# EAGLE design ProgrammableOLED (EAGLE 7.3.0)
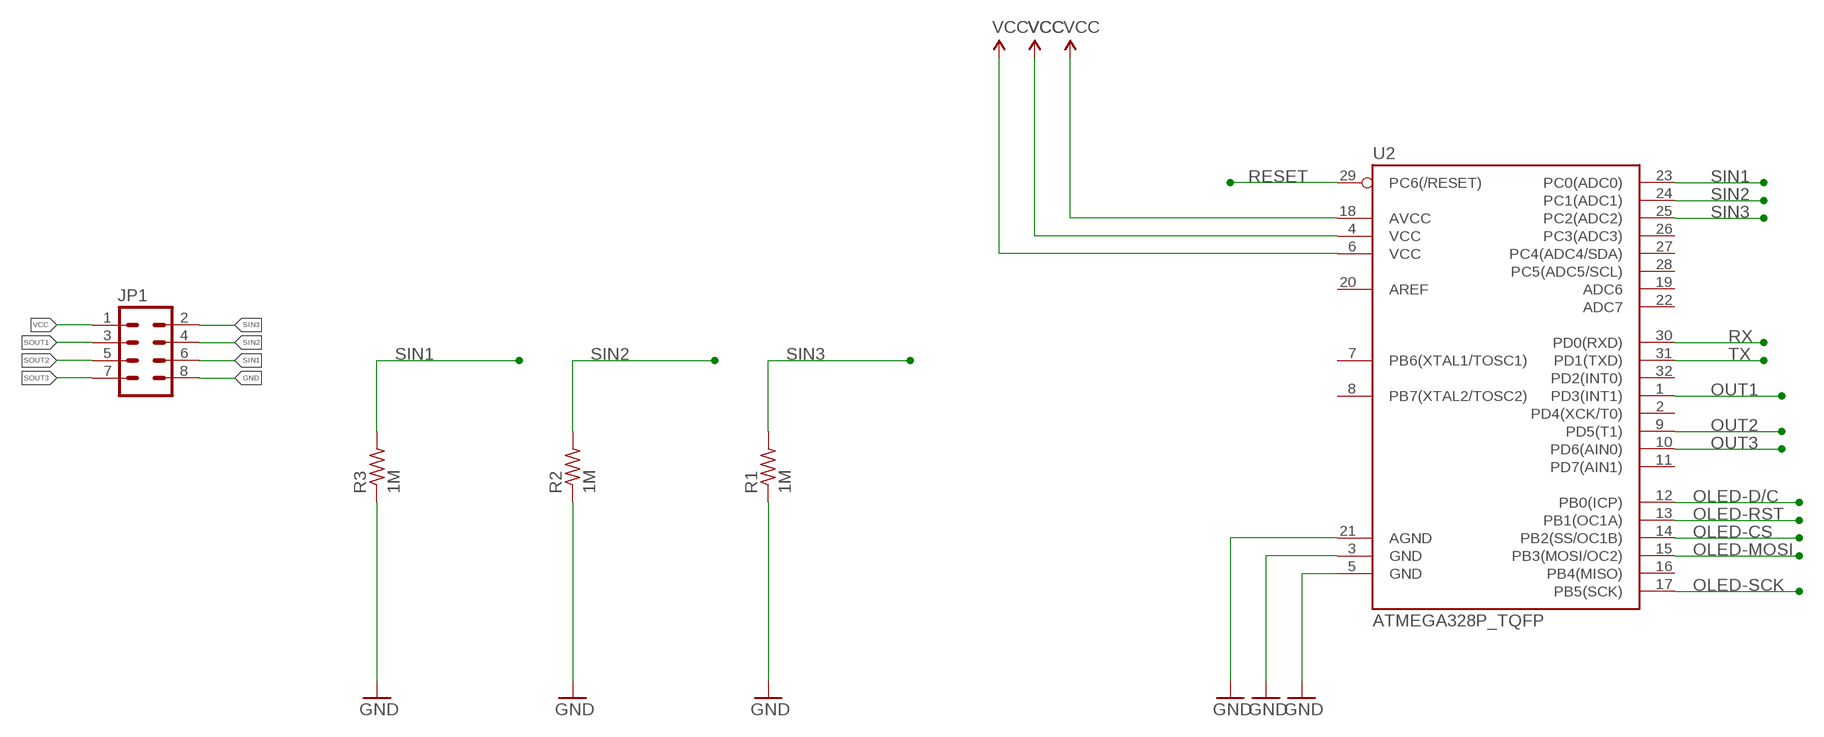
[diagram p0: schematic, sheet 1, part 1 of 2]
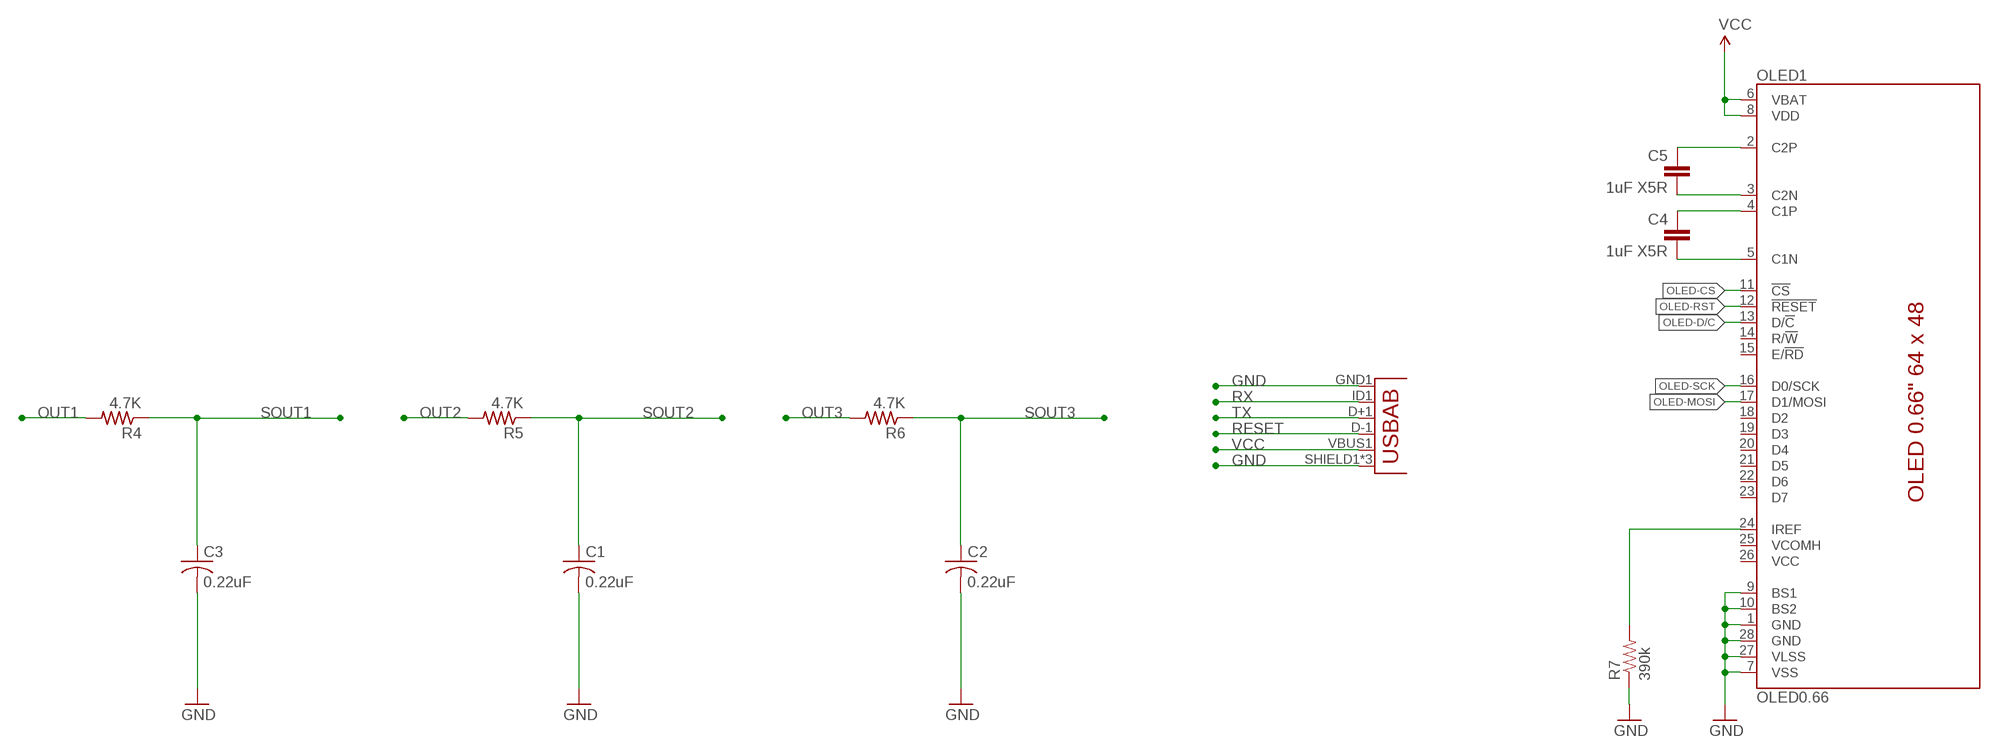
[diagram p1: schematic, sheet 1, part 2 of 2]

## Parts
C1  0.22uF  C-USC0603  [C0603]
C2  0.22uF  C-USC0603  [C0603]
C3  0.22uF  C-USC0603  [C0603]
C4  1uF X5R  CAP0805  [0805]
C5  1uF X5R  CAP0805  [0805]
JP1  M04X2  [2X4]
JP5  USB-ABCONN-11794  [USB-AB-MICRO-SMD_V03]
OLED1  OLED0.66  [OLED-0.66-64X48]
R1  1M  R-US_R0603  [R0603]
R2  1M  R-US_R0603  [R0603]
R3  1M  R-US_R0603  [R0603]
R4  4.7K  R-US_R0603  [R0603]
R5  4.7K  R-US_R0603  [R0603]
R6  4.7K  R-US_R0603  [R0603]
R7  390k  RESISTOR0603-RES  [0603-RES]
U2  ATMEGA328P_TQFP  [TQFP32-08]

## Nets
C1N: C4.2 OLED1.5(C1N)
C1P: C4.1 OLED1.4(C1P)
C2N: C5.2 OLED1.3(C2N)
C2P: C5.1 OLED1.2(C2P)
GND: C1.2 C2.2 C3.2 JP1.8 JP5.GND1(GND) JP5.SHIELD1(SHIELD) JP5.SHIELD2(SHIELD) JP5.SHIELD3(SHIELD) OLED1.1(GND) OLED1.7(VSS) OLED1.9(BS1) OLED1.10(BS2) OLED1.27(VLSS) OLED1.28(GND) R1.1 R2.1 R3.1 R7.1 U2.3(GND) U2.5(GND) U2.21(AGND)
IREF: OLED1.24(IREF) R7.2
OLED-CS: OLED1.11(!CS!) U2.14(PB2(SS/OC1B))
OLED-D/C: OLED1.13(D/!C!) U2.12(PB0(ICP))
OLED-MOSI: OLED1.17(D1/MOSI) U2.15(PB3(MOSI/OC2))
OLED-RST: OLED1.12(!RESET!) U2.13(PB1(OC1A))
OLED-SCK: OLED1.16(D0/SCK) U2.17(PB5(SCK))
OUT1: R4.2 U2.1(PD3(INT1))
OUT2: R5.2 U2.9(PD5(T1))
OUT3: R6.2 U2.10(PD6(AIN0))
RESET: JP5.D-1(D-) U2.29(PC6(/RESET))
RX: JP5.ID1(USBID) U2.30(PD0(RXD))
SIN1: JP1.6 R3.2 U2.23(PC0(ADC0))
SIN2: JP1.4 R2.2 U2.24(PC1(ADC1))
SIN3: JP1.2 R1.2 U2.25(PC2(ADC2))
SOUT1: C3.1 JP1.3 R4.1
SOUT2: C1.1 JP1.5 R5.1
SOUT3: C2.1 JP1.7 R6.1
TX: JP5.D+1(D+) U2.31(PD1(TXD))
VCC: JP1.1 JP5.VBUS1(VBUS) OLED1.6(VBAT) OLED1.8(VDD) U2.4(VCC) U2.6(VCC) U2.18(AVCC)
Unconnected: OLED1.14(R/!W!) OLED1.15(E/!RD!) OLED1.18(D2) OLED1.19(D3) OLED1.20(D4) OLED1.21(D5) OLED1.22(D6) OLED1.23(D7) OLED1.25(VCOMH) OLED1.26(VCC) U2.2(PD4(XCK/T0)) U2.7(PB6(XTAL1/TOSC1)) U2.8(PB7(XTAL2/TOSC2)) U2.11(PD7(AIN1)) U2.16(PB4(MISO)) U2.19(ADC6) U2.20(AREF) U2.22(ADC7) U2.26(PC3(ADC3)) U2.27(PC4(ADC4/SDA)) U2.28(PC5(ADC5/SCL)) U2.32(PD2(INT0))

## Library data of the parts
C1-C3 = adafruit:C-US: CAPACITOR, American symbol
C4 C5 = SparkFun-Passives:CAP: Capacitor Standard 0603 ceramic capacitor, and 0.1" leaded capacitor.
JP1 = SparkFun-Connectors:M04X2: .1" header, two rows of four.
JP5 = SparkFun-Connectors:USB-AB: This is a USB AB connector that is compatible with USB OTG. i.e. this connector can serve as a host or device; PROD_ID: CONN-11794
OLED1 = microView-temp:OLED0.66
R1-R6 = adafruit:R-US_: RESISTOR, American symbol
R7 = SparkFun-Passives:RESISTOR: Resistor Basic schematic elements and footprints for 0603, 1206, and PTH resistors.
U2 = SparkFun-DigitalIC:ATMEGA328P_TQFP; PROD_ID: IC-09069

## Board
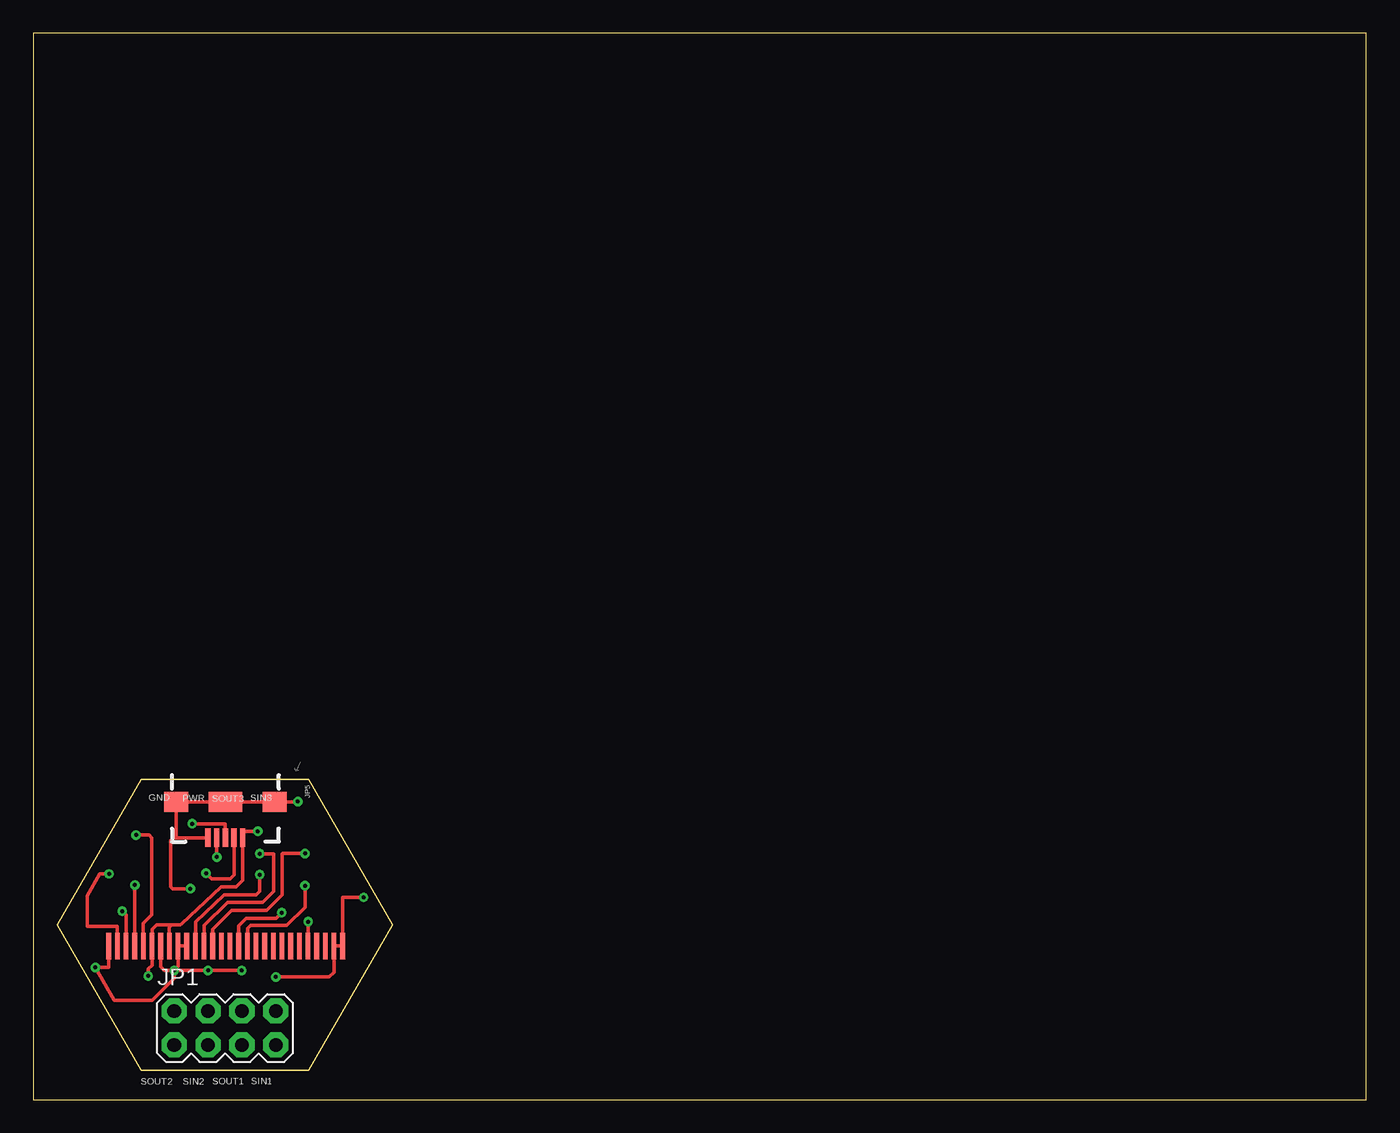
[diagram p2: board, top side]
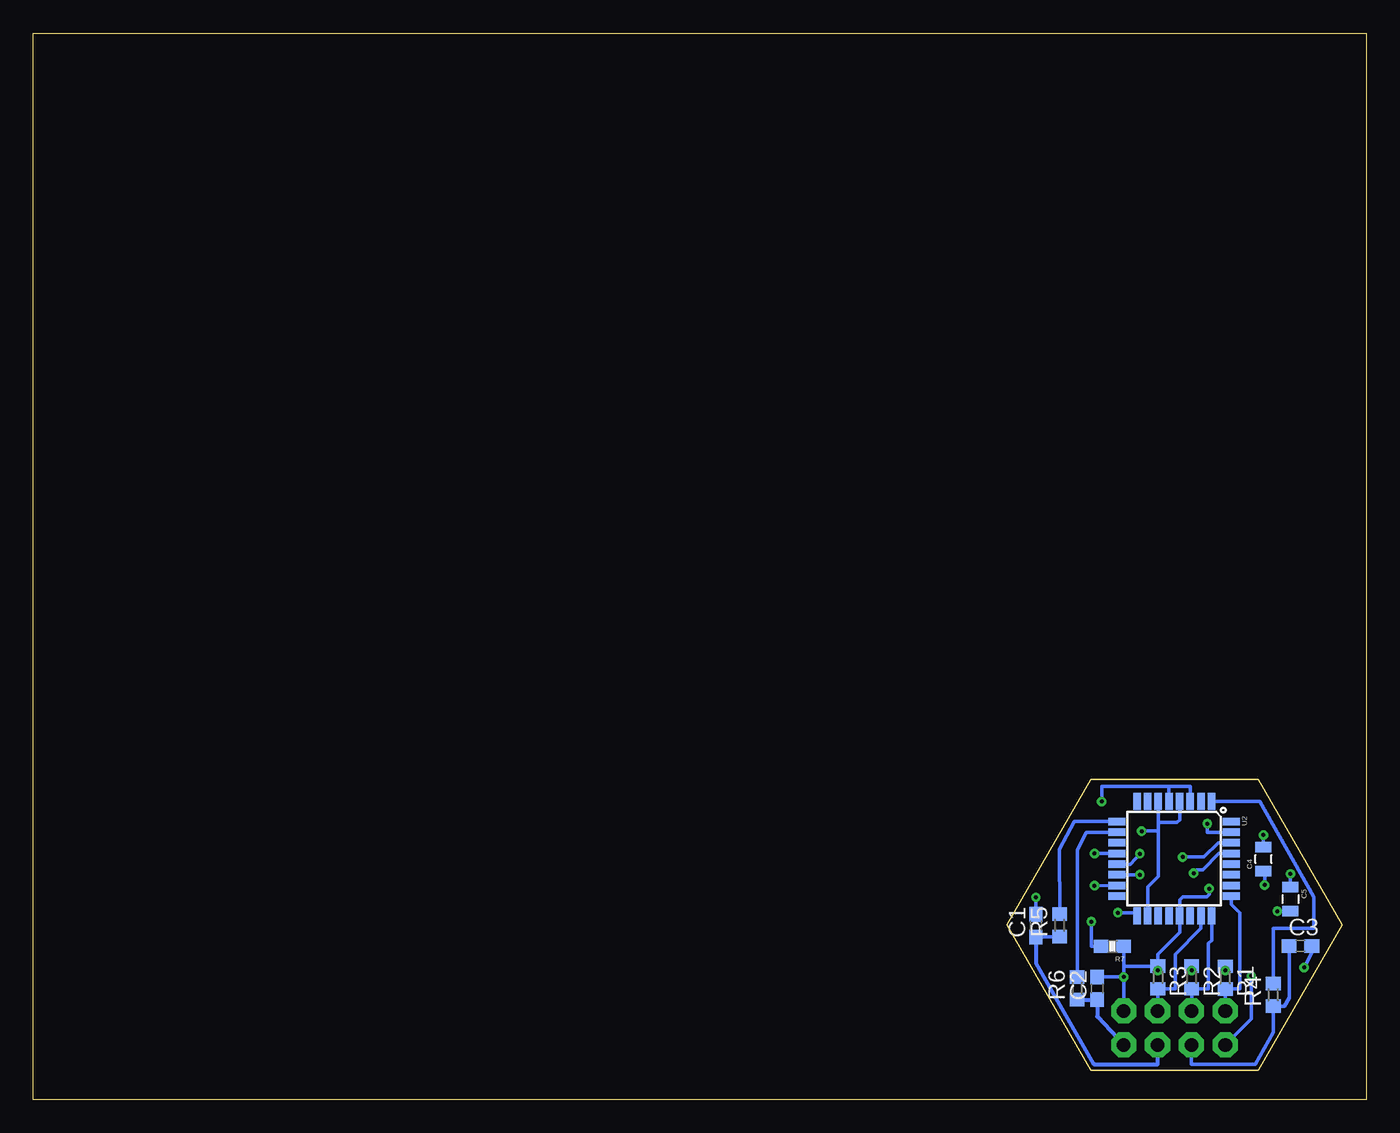
[diagram p3: board, bottom side, seen from below]

Size 100 x 80 mm. Coordinates in mm from the lower left corner, seen from the top.
Outline: 0,0 100,0 100,80 0,80 0,0
Outline: 8.08,24.01 20.67,24.01 26.97,13.1 20.67,2.2 8.08,2.2 1.78,13.1 8.08,24.01
Copper layers (1*16): Top 0.035mm / dielectric 1.5mm / Bottom 0.035mm
Design rules "default *": minimum track width 10mil, minimum drill 24mil, track to track 8mil, track to pad 8mil, pad to pad 8mil, via to via 8mil, smd to smd 8mil, copper to edge 0mil, drill to drill 8mil, minimum pad ring 10mil, minimum via ring 8mil, stop-mask expansion 4mil, vias tented up to drill 0mil, thermal gap 10mil

### Footprints (pad centres in the part's own frame; a part is rotated, then mirrored left to right if it is on the bottom)
C0603 = smd 1.1 x 1: 1 -0.85,0; 2 0.85,0
0805 = smd 0.8 x 1.2: 1 -0.9,0; 2 0.9,0
2X4 = drill 1.016 pad 1.88 octagon: 1 -3.81,-1.27; 2 -3.81,1.27; 3 -1.27,-1.27; 4 -1.27,1.27; 5 1.27,-1.27; 6 1.27,1.27; 7 3.81,-1.27; 8 3.81,1.27
USB-AB-MICRO-SMD_V03 = smd 1.4 x 0.4: D+1 2.7,0; D-1 2.7,0.65; GND1 2.7,-1.3; ID1 2.7,-0.65; VBUS1 2.7,1.3 | smd 1.5 x 1.8: SHIELD1 0,3.68; SHIELD3 0,-3.68 | smd 1.5 x 2.5: SHIELD2 0,0
OLED-0.66-64X48 = smd 0.35 x 2: 1 0,0; 2 0.65,0; 3 1.3,0; 4 1.95,0; 5 2.6,0; 6 3.25,0; 7 3.9,0; 8 4.55,0; 9 5.2,0; 10 5.85,0; 11 6.5,0; 12 7.15,0; 13 7.8,0; 14 8.45,0; 15 9.1,0; 16 9.75,0; 17 10.4,0; 18 11.05,0; 19 11.7,0; 20 12.35,0; 21 13,0; 22 13.65,0; 23 14.3,0; 24 14.95,0; 25 15.6,0; 26 16.25,0; 27 16.9,0; 28 17.55,0
R0603 = smd 1 x 1.1: 1 -0.85,0; 2 0.85,0
0603-RES = smd 1.1 x 1: 1 -0.85,0; 2 0.85,0
TQFP32-08 = smd 1.27 x 0.559: 1 -4.293,2.8; 2 -4.293,2; 3 -4.293,1.2; 4 -4.293,0.4; 5 -4.293,-0.4; 6 -4.293,-1.2; 7 -4.293,-2; 8 -4.293,-2.8; 17 4.293,-2.8; 18 4.293,-2; 19 4.293,-1.2; 20 4.293,-0.4; 21 4.293,0.4; 22 4.293,1.2; 23 4.293,2; 24 4.293,2.8 | smd 0.559 x 1.27: 9 -2.8,-4.293; 10 -2,-4.293; 11 -1.2,-4.293; 12 -0.4,-4.293; 13 0.4,-4.293; 14 1.2,-4.293; 15 2,-4.293; 16 2.8,-4.293; 25 2.8,4.293; 26 2,4.293; 27 1.2,4.293; 28 0.4,4.293; 29 -0.4,4.293; 30 -1.2,4.293; 31 -2,4.293; 32 -2.8,4.293

### Placement (x,y rotation side)
C1  24.78,13.05 90 bottom
C2  20.18,8.34 90 bottom
C3  4.93,11.52 0 bottom
C4  7.71,18.05 90 bottom
C5  5.68,15.03 270 bottom
JP1  14.38,5.37 0 top
JP5  14.41,22.34 270 top
OLED1  5.66,11.52 0 top
R1  10.57,9.15 270 bottom
R2  13.09,9.16 270 bottom
R3  15.63,9.16 270 bottom
R4  6.97,7.86 90 bottom
R5  23,13.07 90 bottom
R6  21.68,8.34 90 bottom
R7  19.04,11.49 180 bottom
U2  14.4,18.06 270 bottom

### Tracks (layer width: path | path; a pad name or v marks a point on that pad's centre or on a via)
C1N  (via drill 0.3 pad 0.25)
  Top 0.254: v7.71,19.84 8.7,19.84 8.89,19.65 8.89,13.86 8.25,13.22 OLED1.5
  Bottom 0.254: C4.2 v7.71,19.84
C1P  (via drill 0.3 pad 0.25)
  Top 0.254: OLED1.4 v7.61,16.1
  Bottom 0.254: v7.61,16.1 7.61,17.05 C4.1
C2N  (via drill 0.3 pad 0.25)
  Top 0.254: OLED1.3 6.96,13.84 v6.67,14.13
  Bottom 0.254: v6.67,14.13 C5.2
C2P  (via drill 0.3 pad 0.25)
  Top 0.254: OLED1.2 6.31,12.98 4.03,12.98 4.03,15.27 4.98,16.93 v5.69,16.93
  Bottom 0.254: v5.69,16.93 C5.1
GND  (via drill 0.3 pad 0.25)
  Top 0.254: OLED1.10 OLED1.9 10.86,9.98 v10.57,9.69 | 10.76,19.64 10.5,19.64 10.32,19.46 10.32,15.95 10.45,15.82 v11.78,15.82 | 10.76,19.64 JP5.GND1 | v18.19,9.19 22.19,9.19 22.56,9.56 OLED1.27 OLED1.28 23.21,15.16 23.22,15.17 v24.78,15.17 | OLED1.1 5.66,9.91 v4.66,9.91 6.05,7.43 8.91,7.43 10.57,9.09 v10.57,9.69 | v15.63,9.69 v13.1,9.69 v10.57,9.69 | OLED1.7 9.56,9.96 9.83,9.69 v10.57,9.69 | v19.84,22.36 19.82,22.34 JP5.SHIELD1 JP5.SHIELD2 JP5.SHIELD3 10.73,19.67 10.76,19.64
  Bottom 0.254: R7.1 18.19,10.41 | R3.1 18.2,10 18.19,10.41 | R3.1 15.63,10.91 14,12.54 U2.21 14,14.97 13.75,15.22 11.96,15.21 11.78,15.39 v11.78,15.82 | 18.19,10.41 18.19,9.23 | 18.19,9.23 JP1.8 | 18.22,9.2 18.19,9.23 | 18.22,9.2 v18.19,9.19 | 18.22,9.2 C2.2 | C1.2 v24.78,15.17 | C3.2 4.08,11.02 v4.66,9.91 | R3.1 v15.63,9.69 | v13.1,9.69 R2.1 | R1.1 v10.57,9.69 | U2.3 13.2,23.51 14.79,23.51 | 14.79,23.51 19.83,23.51 v19.84,22.36 | U2.5 14.8,23.5 14.79,23.51
IREF  (via drill 0.3 pad 0.25)
  Top 0.254: OLED1.24 v20.62,13.34
  Bottom 0.254: v20.62,13.34 20.61,11.49 R7.2
OLED-CS  (via drill 0.3 pad 0.25)
  Top 0.254: v16.98,16.86 16.98,15.63 16.72,15.37 14.32,15.37 12.17,13.33 OLED1.11
  Bottom 0.254: U2.14 v16.98,16.86
OLED-D/C  (via drill 0.3 pad 0.25)
  Top 0.254: OLED1.13 13.46,12.77 14.87,14.18 17.52,14.18 18.68,15.34 18.68,18.45 U2.12 v20.39,18.46
  Bottom 0.254: U2.12 v20.39,18.46
OLED-MOSI  (via drill 0.3 pad 0.25)
  Top 0.254: v20.39,16.05 20.39,14.43 19.02,13.06 16.29,13.06 16.07,12.84 OLED1.17
  Bottom 0.254: U2.15 v20.39,16.05
OLED-RST  (via drill 0.3 pad 0.25)
  Top 0.254: OLED1.12 12.82,13.06 14.57,14.81 17.22,14.81 18.04,15.63 18.04,18.44 v16.98,18.44
  Bottom 0.254: v16.98,18.44 17.7,17.65 U2.13
OLED-SCK  (via drill 0.3 pad 0.25)
  Top 0.254: OLED1.16 15.41,13.05 15.96,13.6 18.21,13.6 v18.63,14.02
  Bottom 0.254: v18.63,14.02 17.45,14.02 U2.17
OUT1
  Bottom 0.254: R4.2 6.97,12.86 3.93,12.86 3.93,15.21 7.97,22.36 U2.1
OUT2
  Bottom 0.254: U2.9 21.88,20.86 23.01,18.78 R5.2
OUT3
  Bottom 0.254: R6.2 21.68,18.75 20.99,20.06 U2.10
RESET  (via drill 0.3 pad 0.25)
  Top 0.254: JP5.D-1 15.06,16.84 14.76,16.54 13.39,16.54 v12.95,16.98
  Bottom 0.254: U2.29 11.04,18.46 12.27,17.23 12.7,17.23 v12.95,16.98
RX  (via drill 0.3 pad 0.25)
  Top 0.254: JP5.ID1 v13.76,18.19
  Bottom 0.254: U2.30 11.11,19.26 12.18,18.19 v13.76,18.19
SIN1
  Bottom 0.254: U2.23 12.4,12.83 14.32,10.91 14.32,8.31 R3.2 15.63,6.66 JP1.6
SIN2
  Bottom 0.254: U2.24 11.6,11.96 11.83,11.73 11.83,8.31 R2.2 13.09,6.66 JP1.4
SIN3
  Bottom 0.254: JP1.2 R1.2 9.47,8.3 9.47,14.01 10.11,14.65 U2.25
SOUT1
  Bottom 0.254: JP1.3 13.11,2.65 8.32,2.65 6.98,5.03 R4.1 6.13,7.01 5.78,7.64 C3.1
SOUT2
  Bottom 0.254: R5.1 C1.1
  Bottom 0.305: C1.1 24.78,10.24 20.42,2.66 15.64,2.66 JP1.5
SOUT3
  Bottom 0.305: R6.1 C2.1 20.17,6.23 JP1.7
TX  (via drill 0.3 pad 0.25)
  Top 0.254: v11.92,20.69 14.4,20.69 JP5.D+1
  Bottom 0.254: U2.31 10.14,20.03 | v11.92,20.69 11.92,20.06 11.59,20.06 U2.31 | U2.31
VCC  (via drill 0.3, 0.3 pad 0.25)
  Top 0.254: v8.62,9.27 8.62,9.8 8.9,10.08 OLED1.6 8.91,12.76 9.24,13.09 10.37,13.09 | OLED1.8 10.21,12.93 10.37,13.09 | 10.37,13.09 11.02,13.09 11.12,13.2 14.09,15.95 15.2,15.95 15.7,16.45 JP5.VBUS1 15.75,19.68 15.75,20.16 15.78,20.13 v16.84,20.13
  Bottom 0.254: 16.42,13.79 U2.18 16.4,15.95 15.6,16.75 15.6,20.14 | JP1.1 8.61,6.06 v8.61,9.26 v8.62,9.27 | U2.6 15.6,20.77 | 15.6,20.77 15.6,20.14 | U2.4 14,21 14.22,20.78 15.59,20.78 15.6,20.77 | 15.6,20.14 v16.83,20.14 v16.84,20.13

### Text on the board
tPlace: GND | PWR | SOUT3 | SIN3 | SOUT2 | SIN2 | SOUT1 | SIN1